# EAGLE design M515X (EAGLE 6.6.0)
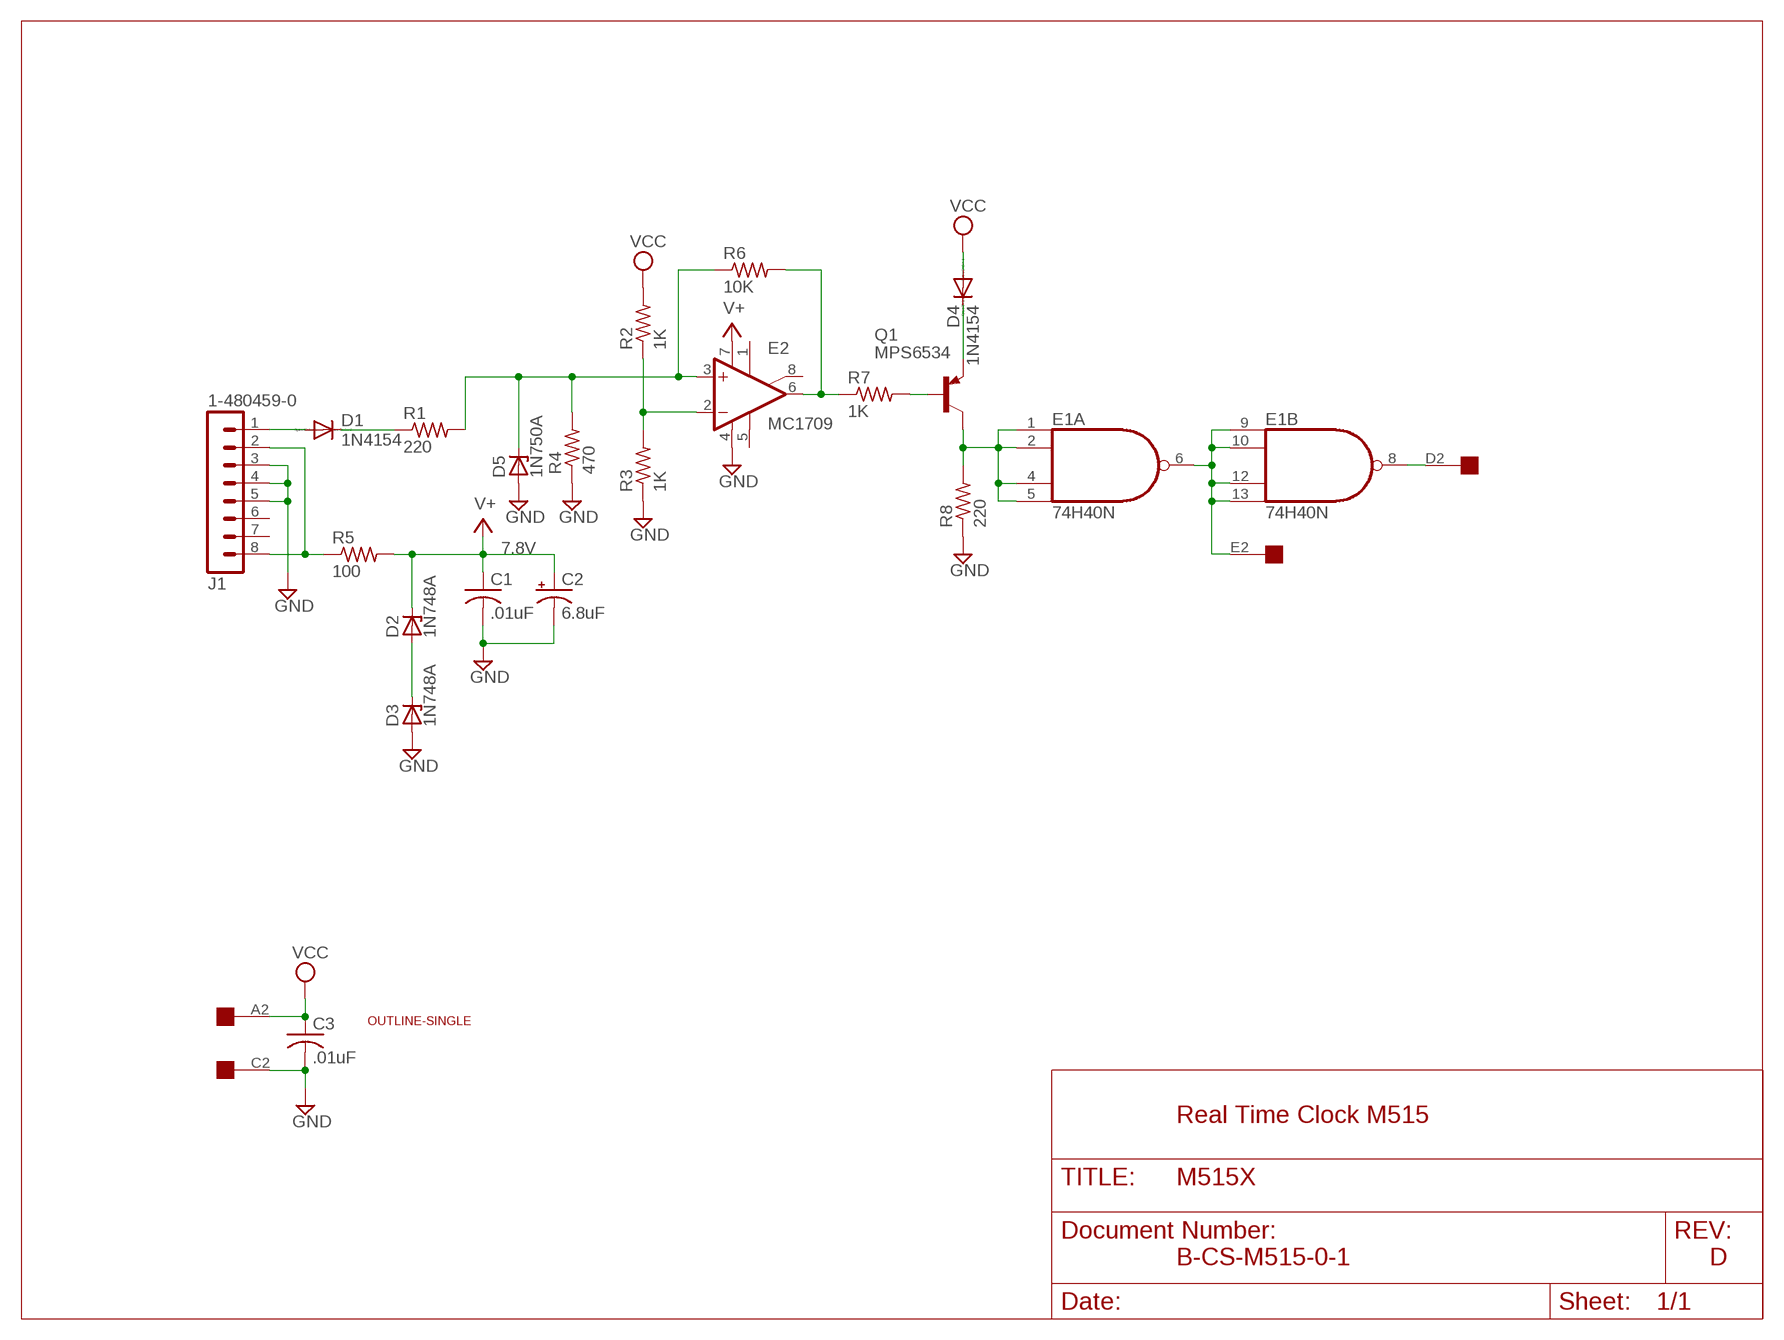
[diagram p0: schematic, sheet 1]

## Parts
C1  .01uF  C-US050-025X075  [C050-025X075]
C2  6.8uF  CPOL-USE20-8AXIAL  [E12-8]
C3  .01uF  C-US050-025X075  [C050-025X075]
D1  1N4154  DIODE-DO35-10  [DO35-10]
D2  1N748A  ZENER-DIODEDO35Z10  [DO35Z10]
D3  1N748A  ZENER-DIODEDO35Z10  [DO35Z10]
D4  1N4154  DIODE-DO35-10  [DO35-10]
D5  1N750A  ZENER-DIODEDO35Z10  [DO35Z10]
E1  74H40N  74S40N  [DIL14]
E2  MC1709  [H08C]
J1  1-480459-0  [1-480459-0]
Q1  MPS6534  -PNP-TO5  [TO5]
R1  220  R-US_0207/10  [0207/10]
R2  1K  R-US_0207/10  [0207/10]
R3  1K  R-US_0207/10  [0207/10]
R4  470  R-US_0207/10  [0207/10]
R5  100  R-US_0207/10  [0207/10]
R6  10K  R-US_0207/10  [0207/10]
R7  1K  R-US_0207/10  [0207/10]
R8  220  R-US_0207/10  [0207/10]
U$1  OUTLINE-SINGLE  [SINGLE]
U$3  EDGE-1  [EDGE-CON1]

## Nets
GND: C1.2 C2.- C3.2 D3.A D5.A E2.4(V-) J1.3 J1.4 J1.5 R3.1 R4.1 R8.1 U$3.C2
N$1: D1.A J1.1
N$2: D2.A D3.C
N$3: J1.2 J1.8 R5.1
N$4: D1.C R1.1
N$5: D5.C E2.3(+IN) R1.2 R4.2 R6.1
N$6: E1.8(B:O) U$3.D2
N$7: E1.6(A:O) E1.9(B:I0) E1.10(B:I1) E1.12(B:I2) E1.13(B:I3) U$3.E2
N$8: E1.1(A:I0) E1.2(A:I1) E1.4(A:I2) E1.5(A:I3) Q1.3(C) R8.2
N$9: D4.C Q1.1(E)
N$10: Q1.2(B) R7.2
N$11: E2.6(OUT) R6.2 R7.1
N$12: E2.2(-IN) R2.1 R3.2
V+: C1.1 C2.+ D2.C E2.7(V+) R5.2
VCC: C3.1 D4.A R2.2 U$3.A2
Unconnected: E1.3(3:NC) E1.11(11:NC) E2.1(ON1) E2.5(OPT) E2.8(ON2) J1.6 J1.7 U$3.B2 U$3.F2 U$3.H2 U$3.J2 U$3.K2 U$3.L2 U$3.M2 U$3.N2 U$3.P2 U$3.R2 U$3.S2 U$3.T2 U$3.U2 U$3.V2

## Notes on the sheet
- 7.8V
- Real Time Clock M515
- B-CS-M515-0-1 | D

## Power pins joined to a net without a drawn wire
GND: E1.7(P:GND)
VCC: E1.14(P:VCC)

## Library data of the parts
C1 C3 = rcl:C-US: CAPACITOR, American symbol
C2 = dec-con:CPOL-USE20-8AXIAL: A 0.8 inch electrolytic.
D1 D4 = diode:DIODE-: DIODE
D2 D3 D5 = diode:ZENER-DIODE: Z-Diode
E1 = dec-con:74*40: Dual 4-input NAND gate
E2 = dec-con:MC1709: OP AMP
J1 = dec-con:1-480459-0: Mate-N-Lok 1-480459-0, board mounted.
Q1 = transistor:*-PNP-: PNP Transistror
R1-R8 = rcl:R-US_: RESISTOR, American symbol
U$1 = dec-con:OUTLINE-*: Board outlines for DEC boards.
U$3 = dec-con:EDGE-1: Single-Sided DEC Edge Connector -- (side 2)

## Net classes
0 default: width 0.813 mm

## Board
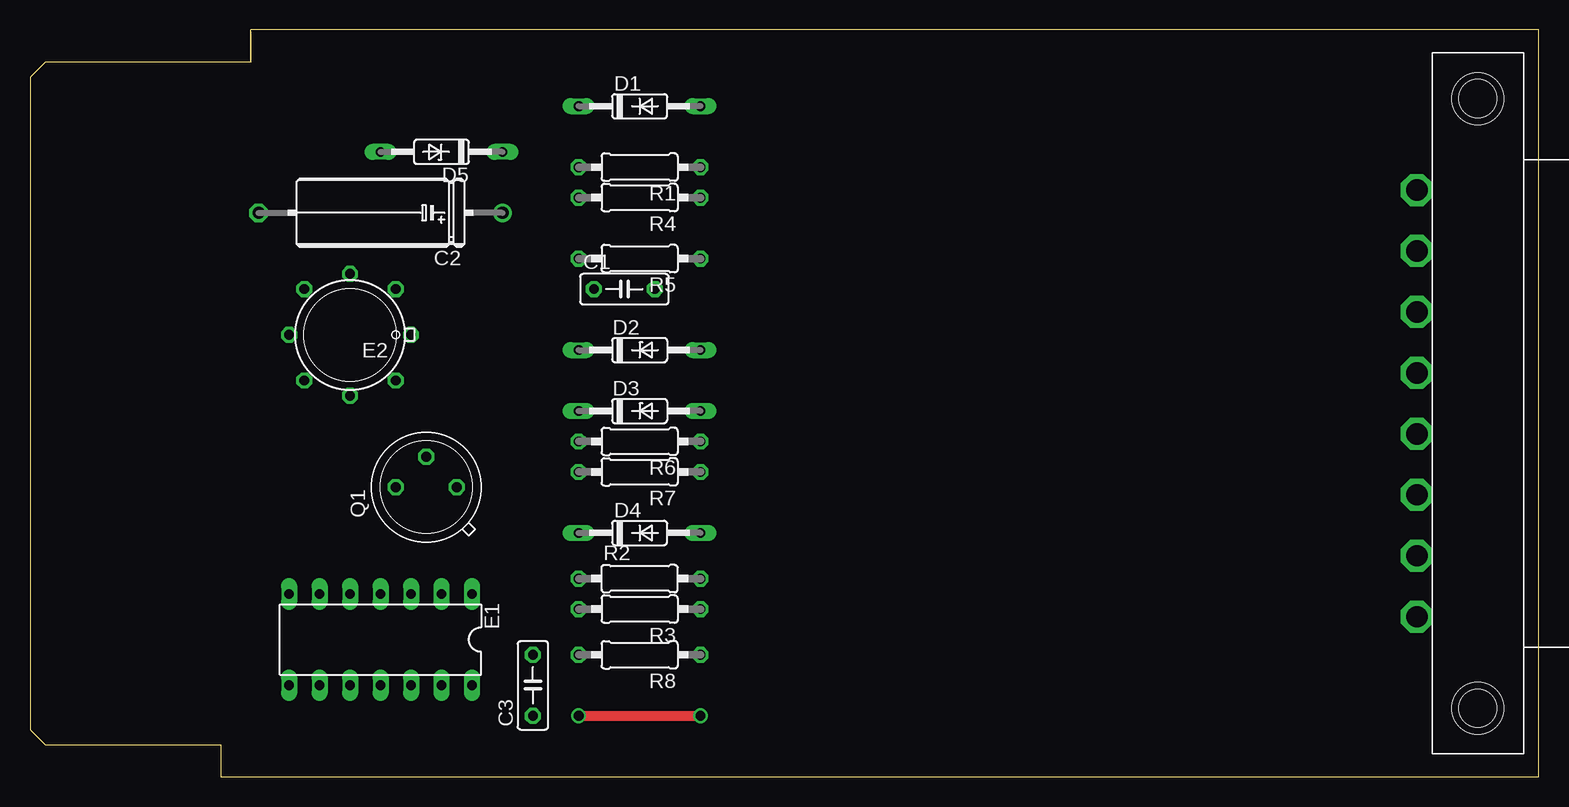
[diagram p1: board, top side]
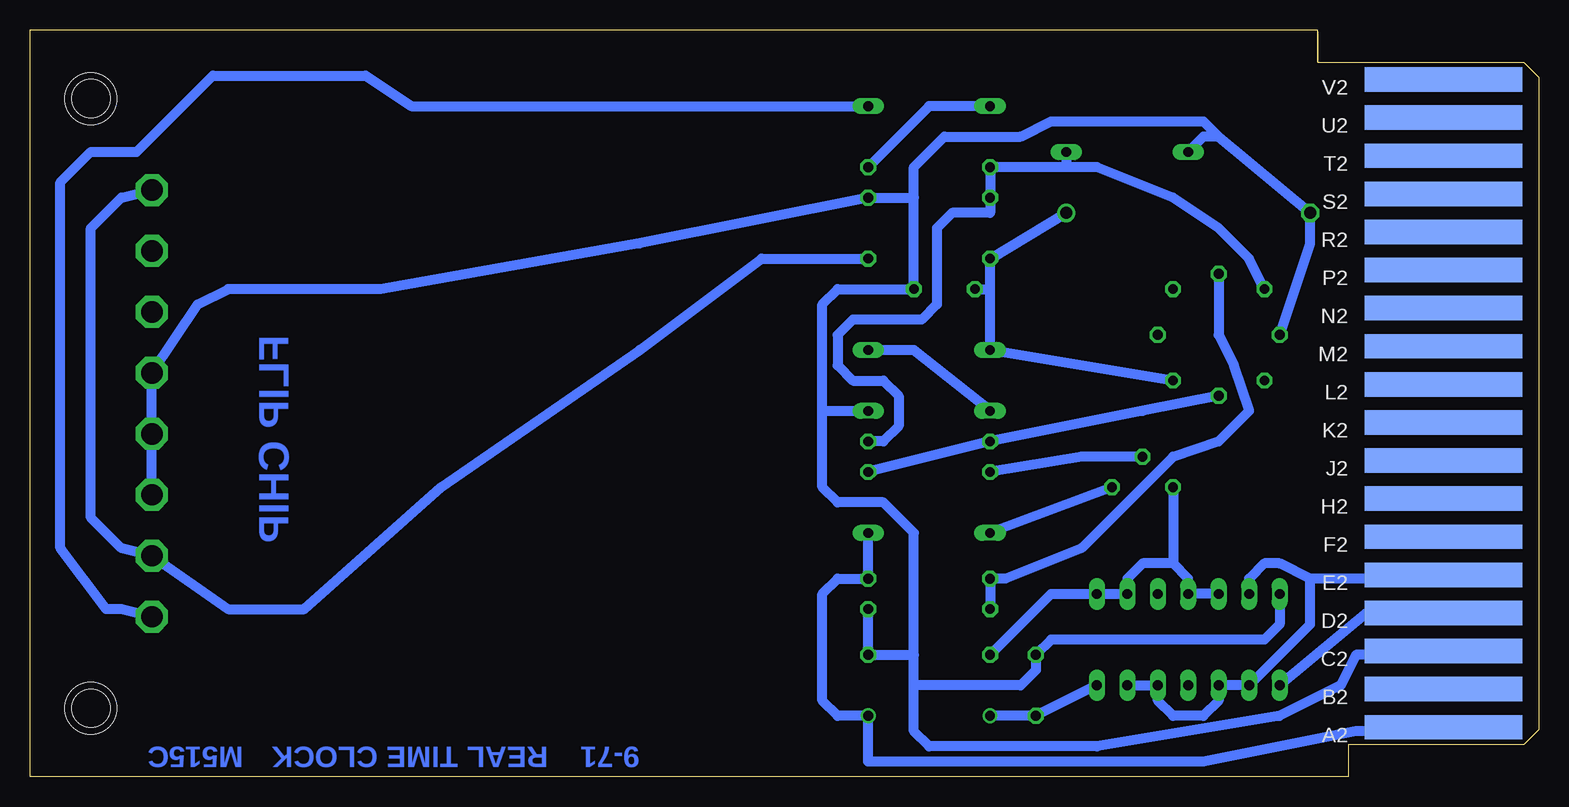
[diagram p2: board, bottom side, seen from below]

Size 125.73 x 62.23 mm. Coordinates in mm from the lower left corner, seen from the top.
Copper layers (1+16): Top 0.035mm / dielectric 1.5mm / Bottom 0.035mm
Design rules "16mils": minimum track width 16mil, minimum drill 32mil, track to track 15mil, track to pad 10mil, pad to pad 10mil, via to via 10mil, smd to smd 10mil, copper to edge 13mil, drill to drill 10mil, minimum pad ring 10mil, minimum via ring 8mil, stop-mask expansion 0mil, vias tented up to drill 0mil, thermal gap 10mil

### Footprints (pad centres in the part's own frame; a part is rotated, then mirrored left to right if it is on the bottom)
C050-025X075 = drill 0.813 octagon: 1 -2.54,0; 2 2.54,0
E12-8 = drill 1.016: + -10.16,0 | drill 1.016 octagon: - 10.16,0
DO35-10 = drill 0.813 long: A 5.08,0; C -5.08,0
DO35Z10 = drill 0.813 long: A 5.08,0; C -5.08,0
DIL14 = drill 0.813 long: 1 -7.62,-3.81; 2 -5.08,-3.81; 3 -2.54,-3.81; 4 0,-3.81; 5 2.54,-3.81; 6 5.08,-3.81; 7 7.62,-3.81; 8 7.62,3.81; 9 5.08,3.81; 10 2.54,3.81; 11 0,3.81; 12 -2.54,3.81; 13 -5.08,3.81; 14 -7.62,3.81
H08C = drill 0.813 octagon: 1 -3.81,-3.81; 2 0,-5.08; 3 3.81,-3.81; 4 5.08,0; 5 3.81,3.81; 6 0,5.08; 7 -3.81,3.81; 8 -5.08,0
1-480459-0 = drill 1.778 octagon: 1 46.99,-1.27; 2 41.91,-1.27; 3 36.83,-1.27; 4 31.75,-1.27; 5 26.67,-1.27; 6 21.59,-1.27; 7 16.51,-1.27; 8 11.43,-1.27 | hole 4.318: 3.81,3.81; 54.61,3.81
TO5 = drill 0.813 octagon: 1 0,-2.54; 2 2.54,0; 3 0,2.54
0207/10 = drill 0.813 octagon: 1 -5.08,0; 2 5.08,0
SINGLE = hole 3.175: 120.65,56.515; 120.65,5.715
EDGE-CON1 = smd 13.106 x 2.032 bottom: A2 7.938,4.128; B2 7.938,7.303; C2 7.938,10.477; D2 7.938,13.652; E2 7.938,16.828; F2 7.938,20.003; H2 7.938,23.177; J2 7.938,26.352; K2 7.938,29.527; L2 7.938,32.703; M2 7.938,35.877; N2 7.938,39.053; P2 7.938,42.227; R2 7.938,45.403; S2 7.938,48.578; T2 7.938,51.752; U2 7.938,54.928; V2 7.938,58.102

### Placement (x,y rotation side)
C1  49.53,40.64 0 top
C2  29.21,46.99 180 top
C3  41.91,7.62 90 top
D1  50.8,55.88 0 top
D2  50.8,35.56 0 top
D3  50.8,30.48 0 top
D4  50.8,20.32 0 top
D5  34.29,52.07 180 top
E1  29.21,11.43 180 top
E2  26.67,36.83 180 top
J1  116.84,60.33 270 top
Q1  33.02,24.13 90 top
R1  50.8,50.8 180 top
R2  50.8,16.51 0 top
R3  50.8,13.97 180 top
R4  50.8,48.26 180 top
R5  50.8,43.18 180 top
R6  50.8,27.94 180 top
R7  50.8,25.4 180 top
R8  50.8,10.16 180 top
U$1  0,0 0 top
U$3  0,0 0 top

### Tracks (layer width: path | path; a pad name or v marks a point on that pad's centre or on a via)
GND
  Bottom 0.813: U$3.C2 8.89,10.16 15.24,10.16 16.51,7.62 21.59,5.08 36.83,2.54 50.8,2.54 52.07,3.81 52.07,7.62 | 52.07,7.62 52.07,10.16 | 52.07,10.16 52.07,20.32 54.61,22.86 58.42,22.86 59.69,24.13 59.69,30.48 | E2.4 19.05,44.45 C2.- 26.67,53.34 | 59.69,30.48 59.69,39.37 58.42,40.64 C1.2 52.07,48.26 | 52.07,48.26 52.07,50.8 49.53,53.34 43.18,53.34 40.64,54.61 27.94,54.61 26.67,53.34 | 26.67,53.34 27.94,53.34 D5.A | 59.69,30.48 D3.A | R3.1 R8.1 52.07,10.16 | E1.7 21.59,12.7 22.86,11.43 40.64,11.43 C3.2 41.91,8.89 43.18,7.62 52.07,7.62 | 52.07,48.26 R4.1 74.93,44.45 96.52,40.64 109.22,40.64 111.76,39.37 J1.5 J1.4 J1.3
N$1
  Bottom 0.813: J1.1 118.11,13.97 119.38,13.97 123.19,19.05 123.19,49.53 120.65,52.07 116.84,52.07 110.49,58.42 97.79,58.42 93.98,55.88 D1.A
N$2
  Bottom 0.813: D3.C 52.07,35.56 D2.A
N$3
  Bottom 0.813: R5.1 64.77,43.18 74.93,35.56 91.44,24.13 102.87,13.97 109.22,13.97 J1.2 118.11,19.05 120.65,21.59 120.65,45.72 118.11,48.26 J1.8
N$4
  Bottom 0.813: D1.C 50.8,55.88 R1.1
N$5
  Bottom 0.813: E2.3 24.13,43.18 26.67,45.72 30.48,48.26 36.83,50.8 39.37,50.8 | 39.37,50.8 R1.2 R4.2 45.72,46.99 48.9,46.99 50.17,45.72 50.17,39.37 51.44,38.1 57.15,38.1 58.42,36.83 58.42,34.29 57.15,33.02 54.61,33.02 53.34,31.75 53.34,29.21 54.61,27.94 R6.1 | D5.C 39.37,50.8
N$6
  Bottom 0.813: U$3.D2 8.89,13.97 13.97,13.97 E1.8
N$7
  Bottom 0.813: U$3.E2 8.89,16.51 19.05,16.51 | 19.05,16.51 21.59,17.78 22.86,17.78 24.13,16.51 E1.6 | 19.05,16.51 19.05,12.7 E1.9 E1.10 26.67,6.35 27.94,5.08 30.48,5.08 31.75,6.35 E1.12 E1.13
N$8
  Bottom 0.813: E1.5 E1.4 29.21,16.51 30.48,17.78 | 30.48,17.78 33.02,17.78 34.29,16.51 E1.2 E1.1 40.64,15.24 R8.2 | Q1.3 30.48,17.78
N$9
  Bottom 0.813: Q1.1 D4.C
N$10
  Bottom 0.813: Q1.2 38.1,26.67 R7.2
N$11
  Bottom 0.813: E2.6 33.02,30.48 R6.2 R7.1
N$12
  Bottom 0.813: E2.2 26.67,36.83 25.4,34.29 24.13,30.48 26.67,27.94 30.48,26.67 38.1,19.05 44.45,16.51 R2.1 R3.2
V+
  Bottom 0.813: E2.7 D2.C 45.72,40.64 | 45.72,40.64 R5.2 C2.+ | C1.1 45.72,40.64
VCC  (via drill 0.81)
  Top 0.813: v45.72,5.08 v55.88,5.08
  Bottom 0.813: U$3.A2 8.89,3.81 15.24,3.81 27.94,1.27 55.88,1.27 v55.88,5.08 58.42,5.08 59.69,6.35 59.69,15.24 58.42,16.51 R2.2 D4.A | E1.14 C3.1 v45.72,5.08

### Text on the board
Bottom: FLIP CHIP | 9-71 | REAL TIME CLOCK | M515C